# Altium schematic sheet current_unit.SchDoc: Модуль измерения тока ИТБ
size 209 x 297 mm; ApprovedBy: Прокопьев; CheckedBy: Прокопьев; Author: Стюф; Organization: НГУ; DocumentNumber: ЮМП.445.020.52 Э3; SheetNumber: 1; SheetTotal: 1; PageSetup: Record=PageOptions|CenterHorizontal=True|CenterVertical=True|PrintScale=1.00|XCorrection=1.00|YCorrection=1.00|PrintKind=1|BorderSize=5000000|LeftOffset=0|BottomOffset=0|Orientation=2|PaperLength=1000|PaperWidth=1000|Scale=100|PaperSource=15|PrintQuality=1200|MediaType=1|DitherType=10|PaperKind=A3|PrintScaleMode=1; Weight: -; ScaleFactor: 1-1
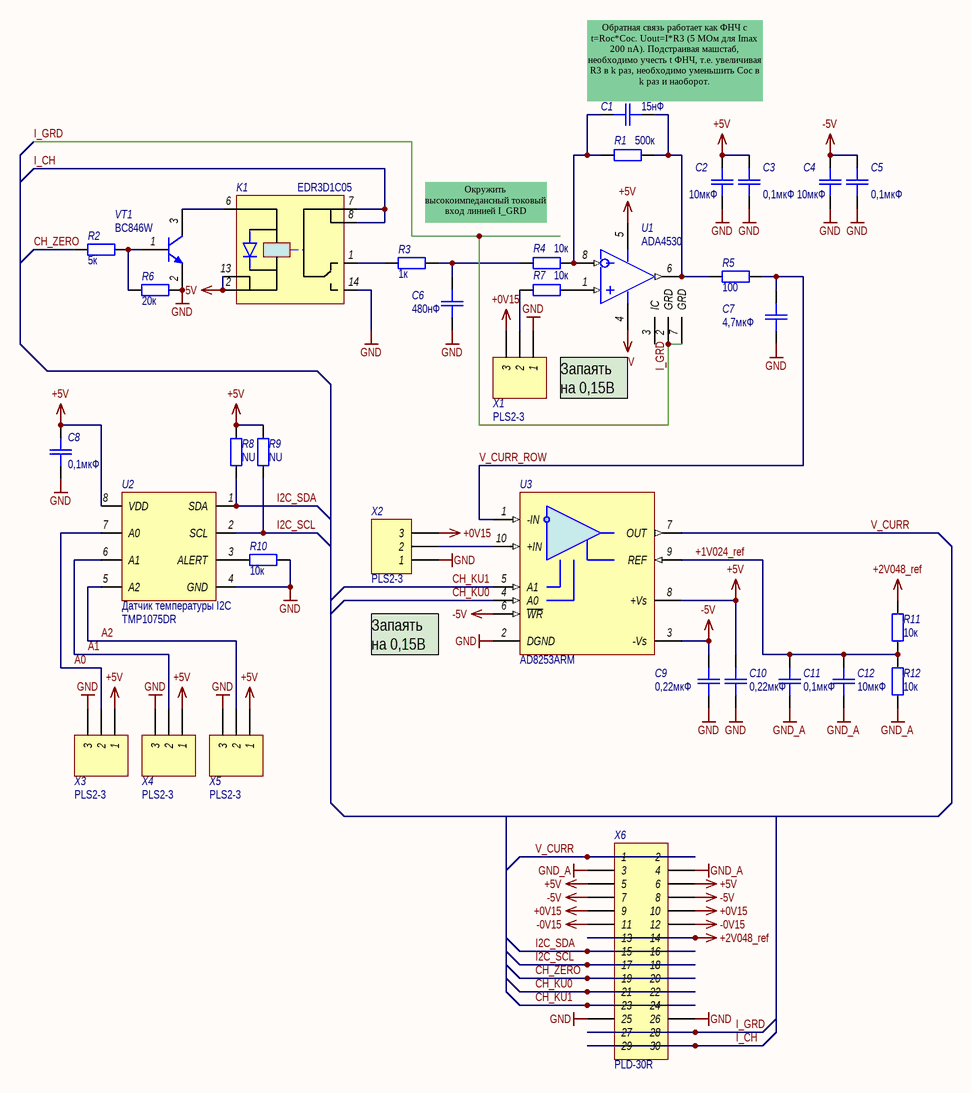
[diagram p0: current_unit.SchDoc]

## Parts
C1  15нФ  [CR-0805]
C2  10мкФ  [CR-0805]
C3  0,1мкФ  [CR-0805]
C4  10мкФ  [CR-0805]
C5  0,1мкФ  [CR-0805]
C6  480нФ  [CR-0805]
C7  4,7мкФ  [CR-0805]
C8  0,1мкФ  [CR-0805]
C9  0,22мкФ  [CR-0805]
C10  0,22мкФ  [CR-0805]
C11  0,1мкФ  [CR-0805]
C12  10мкФ  [CR-0805]
K1  EDR3D1C05  [SOP-14]
R1  500к  [CR-0805]
R2  5к  [CR-0805]
R3  1к  [CR-0805]
R4  10к  [CR-0805]
R5  100  [CR-0805]
R6  20к  [CR-0805]
R7  10к  [CR-0805]
R8  NU  [CR-0805]
R9  NU  [CR-0805]
R10  10к  [CR-0805]
R11  10к  [CR-0805]
R12  10к  [CR-0805]
U1  ADA4530-1  [SOIC-8]  (value not drawn)
U2  Назначение: Датчик температуры I2C  Наименование: TMP1075DR  [SOIC-8]  (hidden comment: TMP1075)
U3  AD8253ARM  [MSOP-10]
VT1  Наименование: BC846W  [SOT-23]  (hidden comment: BC846BWT1)
X1  Наименование: PLS2-3  [SJMP-3]  (hidden comment: MHDR1X3)
X2  Наименование: PLS2-3  [SJMP-3]  (hidden comment: MHDR1X3)
X3  Наименование: PLS2-3  [SJMP-3]  (hidden comment: MHDR1X3)
X4  Наименование: PLS2-3  [SJMP-3]  (hidden comment: MHDR1X3)
X5  Наименование: PLS2-3  [SJMP-3]  (hidden comment: MHDR1X3)
X6  Наименование: PLD-30R  [HDR2X15]  (hidden comment: HDR2X15)

## Nets
+0V15: X1.3 X2.3 X6.9 X6.10
+2V048_ref: R11.1 X6.13 X6.14
+5V: C2.2 C3.2 C8.2 C10.2 K1.2 K1.13 R8.1 R9.1 U1.5(V+) U2.8(VDD) U3.8(+Vs) X3.1 X4.1 X5.1 X6.5 X6.6
-0V15: X6.11 X6.12
-5V: C4.2 C5.2 C9.2 U1.4(V-) U3.3(-Vs) U3.6(~{WR}) X6.7 X6.8
GND: C2.1 C3.1 C4.1 C5.1 C6.1 C7.2 C8.1 C9.1 C10.1 K1.14 R6.1 R10.2 U2.4(GND) U3.2(DGND) VT1.2(E) X1.1 X2.1 X3.3 X4.3 X5.3 X6.25 X6.26
GND_A: C11.1 C12.1 R12.1 X6.3 X6.4
+1V024_ref: C11.2 C12.2 R11.2 R12.2 U3.9(REF)
A0: U2.7(A0) X3.2
A1: U2.6(A1) X4.2
A2: U2.5(A2) X5.2
CH_KU0: U3.4(A0) X6.21 X6.22
CH_KU1: U3.5(A1) X6.23 X6.24
CH_ZERO: R2.2 X6.19 X6.20
I2C_SCL: R9.2 U2.2(SCL) X6.17 X6.18
I2C_SDA: R8.2 U2.1(SDA) X6.15 X6.16
I_CH: K1.7 K1.8 X6.29 X6.30
I_GRD: U1.2(GRD) U1.7(GRD) X6.27 X6.28
V_CURR: U3.7(OUT) X6.1 X6.2
V_CURR_ROW: C7.1 R5.1 U3.1(-IN)
NetC1_1: C1.1 R1.1 R5.2 U1.6(OUT)
NetC1_2: C1.2 R1.2 R4.1 U1.8(IN-)
NetC6_2: C6.2 R3.1 R4.2
NetK1_1: K1.1 R3.2
NetK1_6: K1.6 VT1.3(C)
NetR2_1: R2.1 R6.2 VT1.1(B)
NetR7_1: R7.1 U1.1(IN+)
NetR7_2: R7.2 X1.2
NetR10_1: R10.1 U2.3(ALERT)
NetU3_10: U3.10(+IN) X2.2

Not connected (* = marked no-connect by the designer): U1 3(IC)

## Notes on the sheet
- (near C1) Обратная связь работает как ФНЧ с t=Rос*Cос. Uout=I*R3 (5 МОм для Imax 200 nA). Подстраивая машстаб, необходимо учесть t ФНЧ, т.е. увеличивая R3 в k раз, необходимо уменьшить Cос в k раз и наоборот.
- Окружить высокоимпедансный токовый вход линией I_GRD
- Запаять на 0,15В
- Перв. примен.
- Справ. №
- ПЗ:                             Дата
- Подп. и дата
- Инв. № дубл.
- Взам. инв. №
- Разраб.
- Изм.
- Лист
- № докум.
- Подп.
- Дата
- Литера
- Масса
- Масштаб
- Пров.
- Т.контр.
- Схема электрическая принципиальная
- Листов
- Инв. № подл.
- Н.контр.
- Утв.
- Форма 1 ГОСТ 2.104-2006
- Копировал
- Формат А4

## Library data of the parts
C1-C12 = C_smd: Конденсатор для поверхностного монтажа; Назначение: Чип-конденсатор; Наименование: К10-79 МП0 «ВП»; Потребление, Вт: 0
  C1: Value: 15нФ
  C2 C4 C12: Value: 10мкФ
  C3 C5 C8 C11: Value: 0,1мкФ
  C6: Value: 480нФ
  C7: Value: 4,7мкФ
  C9 C10: Value: 0,22мкФ
K1 = EDR3D1C05: Reed Relay; Назначение: Герконовое реле; Потребление, Вт: 0,125; Наименование: EDR3D1C05
R1-R12 = R_smd: Резистор для поверхностного монтажа; Наименование: Р1-12-0.125 ОСМ; Назначение: Чип-резистор; Потребление, Вт: 0,001
  R1: Value: 500к
  R2: Value: 5к
  R3: Value: 1к
  R4 R7 R10-R12: Value: 10к
  R5: Value: 100
  R6: Value: 20к
  R8 R9: Value: NU
U1 = ADA4530: Ultra-Low Bias Current Difet OpAmp; Назначение: Операционный усилитель с малым входным током; Потребление, Вт: 0,01; Наименование: ADA4530
U2 = TMP1075: TMP1075 Temperature Sensor With I2C and SMBus Interface; Потребление, Вт: 0,001
U3 = AD8253: 10 MHz, 20 V/мs, G = 1, 10, 100, 1000 iCMOS Programmable Gain Instrumentation Amplifier; Назначение: Операционный усилитель с программируемым КУ (1, 10, 100, 1000); Потребление, Вт: 0,05; Наименование: AD8253ARM
VT1 = BC846BWT1: General Purpose Transistor, NPN Silicon, 3-Pin SC70, Tape and Reel; Manufacturer: On Semiconductor; fT Min (MHz): 100; IC Continuous (A): 0.1; Note1: 0; Назначение: Транзистор NPN; Потребление, Вт: 0,01; PackageDescription: 3-Pin Small Outline Transistor, Body 2 x 1.25 mm, Pitch 0.65 mm; PackageVersion: Rev. N, 11/2008; ComponentLink3URL: http://www.onsemi.cn/pub_link/Collateral/419-04.PDF; Polarity: NPN; ComponentLink2Description: Datasheet; Mounting Technology: Surface Mount; ComponentLink3Description: Package Specification; PartNumber: BC846BWT1; RoHS: FALSE; ComponentLink1URL: http://www.onsemi.com/; ComponentLink2URL: http://www.onsemi.cn/pub_link/Collateral/BC846AWT1-D.PDF; Packing: Tape and Reel; PackageReference: SC-70-3-419-04; DatasheetVersion: Rev. 9; ComponentLink1Description: Manufacturer URL
X1-X5 = MHDR1X3: Header, 3-Pin; Назначение: Вилка штыревая 2мм 1х3 прямая; LatestRevisionDate: 17-Jul-2002; LatestRevisionNote: Re-released for DXP Platform.; Publisher: Altium Limited
X6 = HDR2X15: Header, 15-Pin, Dual row; Назначение: Вилка штыревая 2.54мм 2х15 угловая; LatestRevisionDate: 17-Jul-2002; LatestRevisionNote: Re-released for DXP Platform.; Publisher: Altium Limited